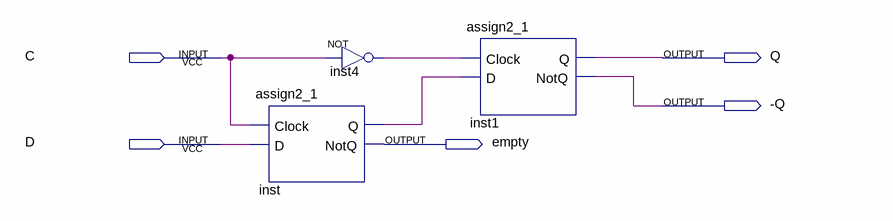
[diagram p0: schematic sheet]
// Quartus schematic assign2_2.bdf as structural Verilog: 3 symbols, 5 pins
module assign2_2 (
  input  C,
  input  D,
  output Q,
  output \-Q ,
  output empty
);

  wire inst4_out, inst_q;

  assign2_1 inst (.Clock(C), .D(D), .Q(inst_q), .NotQ(empty));
  not inst4 (inst4_out, C);
  assign2_1 inst1 (.Clock(inst4_out), .D(inst_q), .Q(Q), .NotQ(\-Q ));
endmodule
